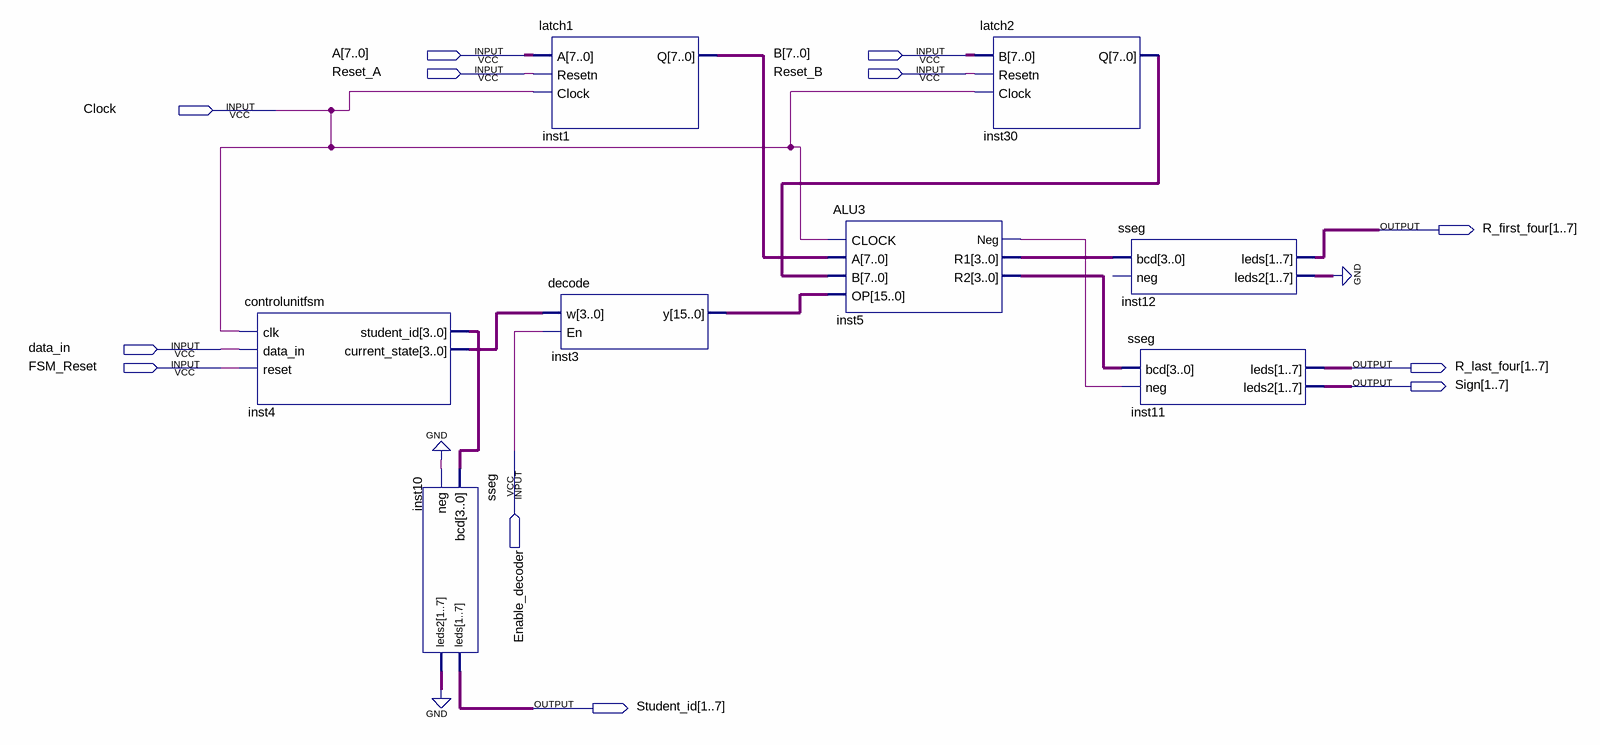
[diagram p0: schematic sheet]
// Quartus schematic FinalDesign.bdf as structural Verilog: 8 symbols, 12 pins
module FinalDesign (
  input  [7:0] A,
  input  [7:0] B,
  input  Reset_A,
  input  Reset_B,
  input  Clock,
  input  data_in,
  input  FSM_Reset,
  input  Enable_decoder,
  output [1:7] R_first_four,
  output [1:7] R_last_four,
  output [1:7] Sign,
  output [1:7] Student_id
);

  wire inst5_neg;
  wire [3:0] inst4_current_state, inst4_student_id, inst5_r1, inst5_r2;
  wire [6:0] inst10_leds2, inst12_leds2;
  wire [7:0] inst1_q, inst30_q;
  wire [15:0] inst3_y;

  controlunitfsm inst4 (
    .clk(Clock), .data_in(data_in), .reset(FSM_Reset), .student_id(inst4_student_id),
    .current_state(inst4_current_state));
  sseg inst10 (.bcd(inst4_student_id), .neg(1'b0), .leds(Student_id), .leds2(inst10_leds2));
  latch1 inst1 (.A(A), .Resetn(Reset_A), .Clock(Clock), .Q(inst1_q));
  decode inst3 (.w(inst4_current_state), .En(Enable_decoder), .y(inst3_y));
  ALU3 inst5 (.CLOCK(Clock), .A(inst1_q), .B(inst30_q), .OP(inst3_y), .Neg(inst5_neg), .R1(inst5_r1), .R2(inst5_r2));
  latch2 inst30 (.B(B), .Resetn(Reset_B), .Clock(Clock), .Q(inst30_q));
  sseg inst12 (.bcd(inst5_r1), .leds(R_first_four), .leds2(inst12_leds2));  // open: neg
  sseg inst11 (.bcd(inst5_r2), .neg(inst5_neg), .leds(R_last_four), .leds2(Sign));
  // also tied to GND on the sheet: {inst10_leds2[0], inst10_leds2[1], inst10_leds2[2], inst10_leds2[3], inst10_leds2[4], inst10_leds2[5], inst10_leds2[6], inst12_leds2[0], inst12_leds2[1], inst12_leds2[2], inst12_leds2[3], inst12_leds2[4], inst12_leds2[5], inst12_leds2[6]}
endmodule
